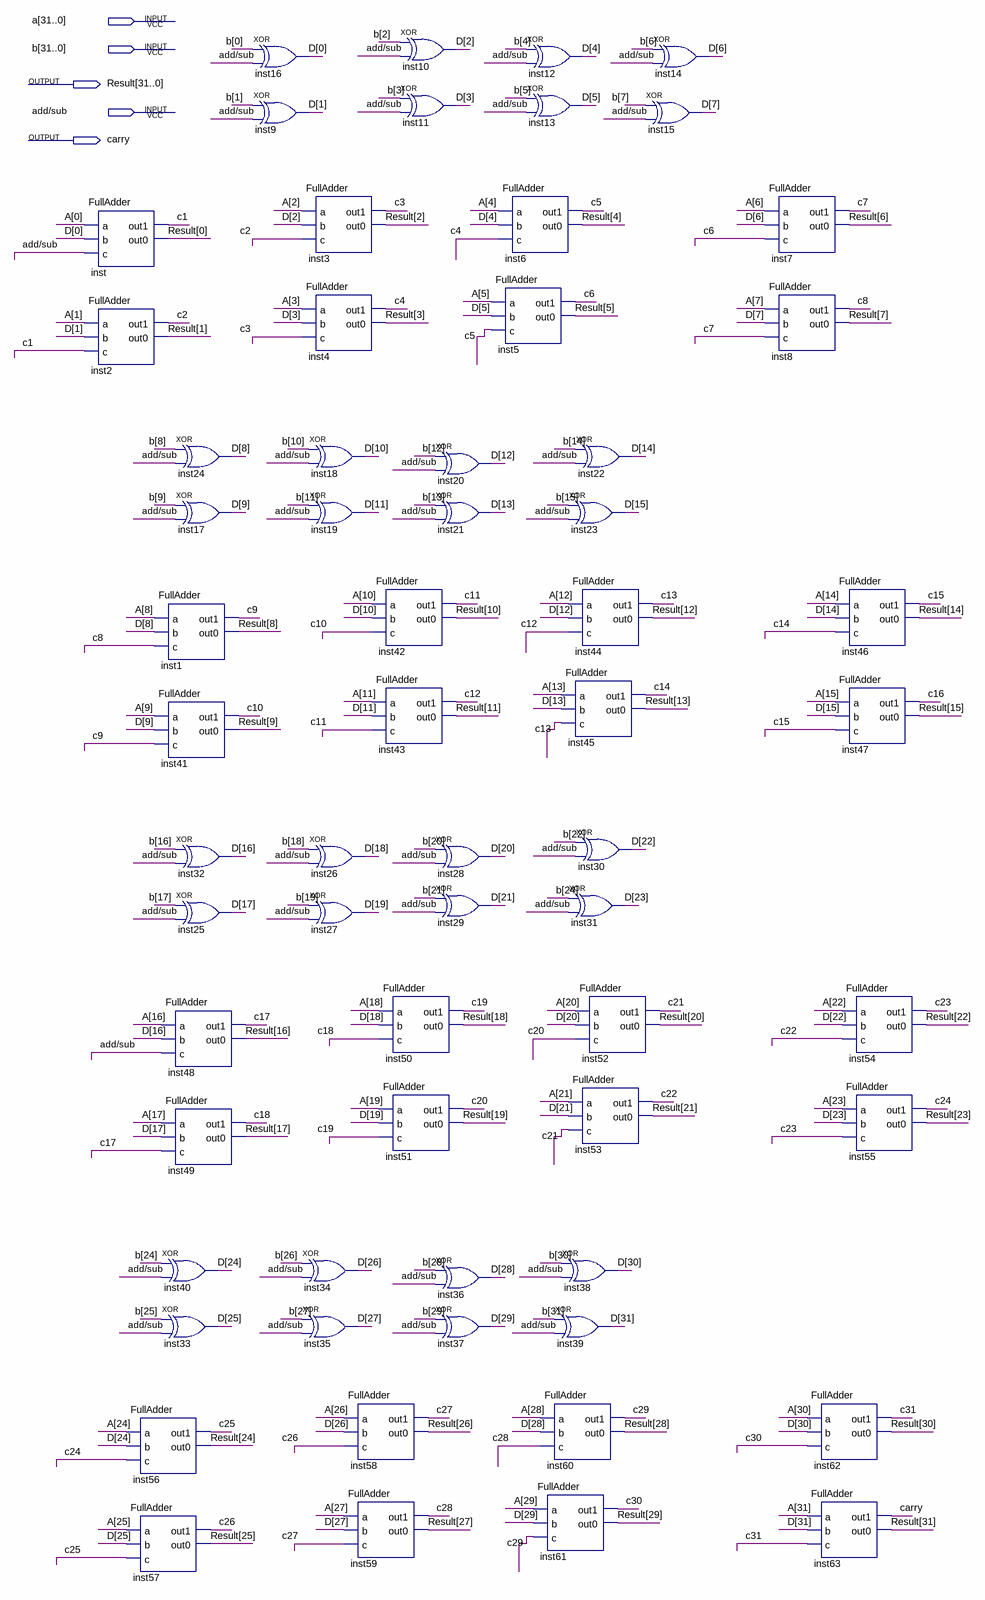
[diagram p0: schematic sheet]
// Quartus schematic Adder8.bdf as structural Verilog: 64 symbols, 5 pins
module Adder8 (
  input  [31:0] a,
  input  [31:0] b,
  input  \add/sub ,
  output [31:0] Result,
  output carry
);

  wire c1, c2, c3, c4, c5, c6, c7, c8, c9, c10, c11, c12, c13, c14, c15, c16, c17, c18, c19, c20, c21, c22,
       c23, c24, c25, c26, c27, c28, c29, c30, c31;
  wire [31:0] D;

  FullAdder inst (.a(a[0]), .b(D[0]), .c(\add/sub ), .out1(c1), .out0(Result[0]));
  FullAdder inst2 (.a(a[1]), .b(D[1]), .c(c1), .out1(c2), .out0(Result[1]));
  FullAdder inst56 (.a(a[24]), .b(D[24]), .c(c24), .out1(c25), .out0(Result[24]));
  FullAdder inst57 (.a(a[25]), .b(D[25]), .c(c25), .out1(c26), .out0(Result[25]));
  xor inst24 (D[8], b[8], \add/sub );
  xor inst17 (D[9], b[9], \add/sub );
  FullAdder inst1 (.a(a[8]), .b(D[8]), .c(c8), .out1(c9), .out0(Result[8]));
  FullAdder inst41 (.a(a[9]), .b(D[9]), .c(c9), .out1(c10), .out0(Result[9]));
  xor inst32 (D[16], b[16], \add/sub );
  xor inst25 (D[17], b[17], \add/sub );
  FullAdder inst48 (.a(a[16]), .b(D[16]), .c(\add/sub ), .out1(c17), .out0(Result[16]));
  FullAdder inst49 (.a(a[17]), .b(D[17]), .c(c17), .out1(c18), .out0(Result[17]));
  xor inst40 (D[24], b[24], \add/sub );
  xor inst33 (D[25], b[25], \add/sub );
  xor inst16 (D[0], b[0], \add/sub );
  xor inst9 (D[1], b[1], \add/sub );
  FullAdder inst3 (.a(a[2]), .b(D[2]), .c(c2), .out1(c3), .out0(Result[2]));
  FullAdder inst4 (.a(a[3]), .b(D[3]), .c(c3), .out1(c4), .out0(Result[3]));
  xor inst34 (D[26], b[26], \add/sub );
  xor inst35 (D[27], b[27], \add/sub );
  xor inst18 (D[10], b[10], \add/sub );
  xor inst19 (D[11], b[11], \add/sub );
  xor inst26 (D[18], b[18], \add/sub );
  xor inst27 (D[19], b[19], \add/sub );
  FullAdder inst58 (.a(a[26]), .b(D[26]), .c(c26), .out1(c27), .out0(Result[26]));
  FullAdder inst59 (.a(a[27]), .b(D[27]), .c(c27), .out1(c28), .out0(Result[27]));
  xor inst10 (D[2], b[2], \add/sub );
  xor inst11 (D[3], b[3], \add/sub );
  FullAdder inst42 (.a(a[10]), .b(D[10]), .c(c10), .out1(c11), .out0(Result[10]));
  FullAdder inst43 (.a(a[11]), .b(D[11]), .c(c11), .out1(c12), .out0(Result[11]));
  FullAdder inst50 (.a(a[18]), .b(D[18]), .c(c18), .out1(c19), .out0(Result[18]));
  FullAdder inst51 (.a(a[19]), .b(D[19]), .c(c19), .out1(c20), .out0(Result[19]));
  xor inst20 (D[12], b[12], \add/sub );
  xor inst21 (D[13], b[13], \add/sub );
  xor inst28 (D[20], b[20], \add/sub );
  xor inst29 (D[21], b[21], \add/sub );
  xor inst36 (D[28], b[28], \add/sub );
  xor inst37 (D[29], b[29], \add/sub );
  xor inst12 (D[4], b[4], \add/sub );
  xor inst13 (D[5], b[5], \add/sub );
  FullAdder inst6 (.a(a[4]), .b(D[4]), .c(c4), .out1(c5), .out0(Result[4]));
  FullAdder inst5 (.a(a[5]), .b(D[5]), .c(c5), .out1(c6), .out0(Result[5]));
  xor inst22 (D[14], b[14], \add/sub );
  xor inst23 (D[15], b[15], \add/sub );
  FullAdder inst44 (.a(a[12]), .b(D[12]), .c(c12), .out1(c13), .out0(Result[12]));
  FullAdder inst45 (.a(a[13]), .b(D[13]), .c(c13), .out1(c14), .out0(Result[13]));
  xor inst30 (D[22], b[22], \add/sub );
  xor inst31 (D[23], b[24], \add/sub );
  FullAdder inst52 (.a(a[20]), .b(D[20]), .c(c20), .out1(c21), .out0(Result[20]));
  FullAdder inst53 (.a(a[21]), .b(D[21]), .c(c21), .out1(c22), .out0(Result[21]));
  xor inst38 (D[30], b[30], \add/sub );
  xor inst39 (D[31], b[31], \add/sub );
  FullAdder inst60 (.a(a[28]), .b(D[28]), .c(c28), .out1(c29), .out0(Result[28]));
  FullAdder inst61 (.a(a[29]), .b(D[29]), .c(c29), .out1(c30), .out0(Result[29]));
  xor inst14 (D[6], b[6], \add/sub );
  xor inst15 (D[7], b[7], \add/sub );
  FullAdder inst7 (.a(a[6]), .b(D[6]), .c(c6), .out1(c7), .out0(Result[6]));
  FullAdder inst8 (.a(a[7]), .b(D[7]), .c(c7), .out1(c8), .out0(Result[7]));
  FullAdder inst62 (.a(a[30]), .b(D[30]), .c(c30), .out1(c31), .out0(Result[30]));
  FullAdder inst63 (.a(a[31]), .b(D[31]), .c(c31), .out1(carry), .out0(Result[31]));
  FullAdder inst46 (.a(a[14]), .b(D[14]), .c(c14), .out1(c15), .out0(Result[14]));
  FullAdder inst47 (.a(a[15]), .b(D[15]), .c(c15), .out1(c16), .out0(Result[15]));
  FullAdder inst54 (.a(a[22]), .b(D[22]), .c(c22), .out1(c23), .out0(Result[22]));
  FullAdder inst55 (.a(a[23]), .b(D[23]), .c(c23), .out1(c24), .out0(Result[23]));
endmodule
